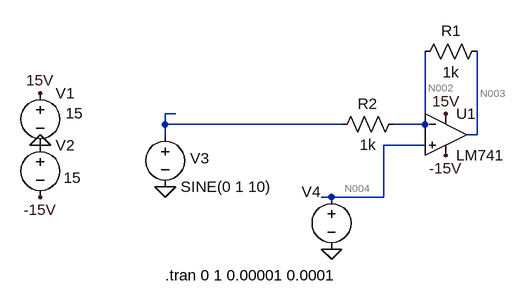
[diagram p0: schematic DCOffsett.asc]
DCOffsett.asc, the LTspice schematic file:
Version 4
SHEET 1 880 680
WIRE -64 80 -80 80
WIRE -80 96 -80 80
WIRE 192 96 -80 96
WIRE 320 96 320 -16
WIRE 320 96 272 96
WIRE -80 112 -80 96
WIRE 400 112 400 -16
WIRE 400 112 384 112
WIRE 320 128 256 128
WIRE 176 208 160 208
WIRE 256 208 256 128
WIRE 256 208 176 208
FLAG -272 128 0
FLAG -272 48 15V
FLAG 352 80 15V
FLAG -272 208 -15V
FLAG 352 144 -15V
FLAG -80 192 0
FLAG 176 288 0
SYMBOL OpAmps\\LM741 352 48 R0
SYMATTR InstName U1
SYMBOL voltage -272 32 R0
WINDOW 123 0 0 Left 0
WINDOW 39 0 0 Left 0
WINDOW 3 39 47 Left 2
SYMATTR Value 15
SYMATTR InstName V1
SYMBOL voltage -272 112 R0
WINDOW 123 0 0 Left 0
WINDOW 39 0 0 Left 0
WINDOW 3 36 66 Left 2
SYMATTR Value 15
SYMATTR InstName V2
SYMBOL voltage -80 96 R0
WINDOW 123 0 0 Left 0
WINDOW 39 0 0 Left 0
WINDOW 0 39 52 Left 2
SYMATTR InstName V3
SYMATTR Value SINE(0 1 10)
SYMBOL res 416 -32 R90
WINDOW 0 0 56 VBottom 2
WINDOW 3 32 56 VTop 2
SYMATTR InstName R1
SYMATTR Value 1k
SYMBOL res 288 80 R90
WINDOW 0 0 56 VBottom 2
WINDOW 3 32 56 VTop 2
SYMATTR InstName R2
SYMATTR Value 1k
SYMBOL voltage 176 192 R0
WINDOW 0 -46 8 Left 2
WINDOW 3 24 96 Invisible 2
WINDOW 123 0 0 Left 0
WINDOW 39 0 0 Left 0
SYMATTR InstName V4
SYMATTR Value 1
TEXT -80 328 Left 2 !.tran 0 1 0.00001 0.0001

The netlist it stands for:
* DCOffsett.asc
XU1 N004 N002 15V -15V N003 LM741  ; pins In+ In- V+ V- OUT
V1 15V 0 15
V2 0 -15V 15
V3 N001 0 SINE(0 1 10)
R1 N003 N002 1k
R2 N002 N001 1k
V4 N004 0 1
.tran 0 1 0.00001 0.0001
.lib LM741.lib
.backanno
.end

* Results of the author's LTspice run, read from the files saved beside the schematic
* Operating Point, zero values left out:
*   V(n002) = 1.001 V
*   V(n004) = 1 V
*   V(-15v) = -15 V
*   V(15v) = 15 V
*   V(n003) = 2.002 V
*   I(R2) = 1.001 mA
*   I(R1) = 1.001 mA
*   I(V4) = -57.83 nA
*   I(V3) = 1.001 mA
*   I(V2) = -1.628 mA
*   I(V1) = -2.628 mA
*   Ix(u1:1) = 57.83 nA
*   Ix(u1:2) = 101.9 nA
*   Ix(u1:99) = 2.628 mA
*   Ix(u1:50) = -1.628 mA
*   Ix(u1:28) = -1.001 mA